# EAGLE schematic fp1 (EAGLE 6.5.0)
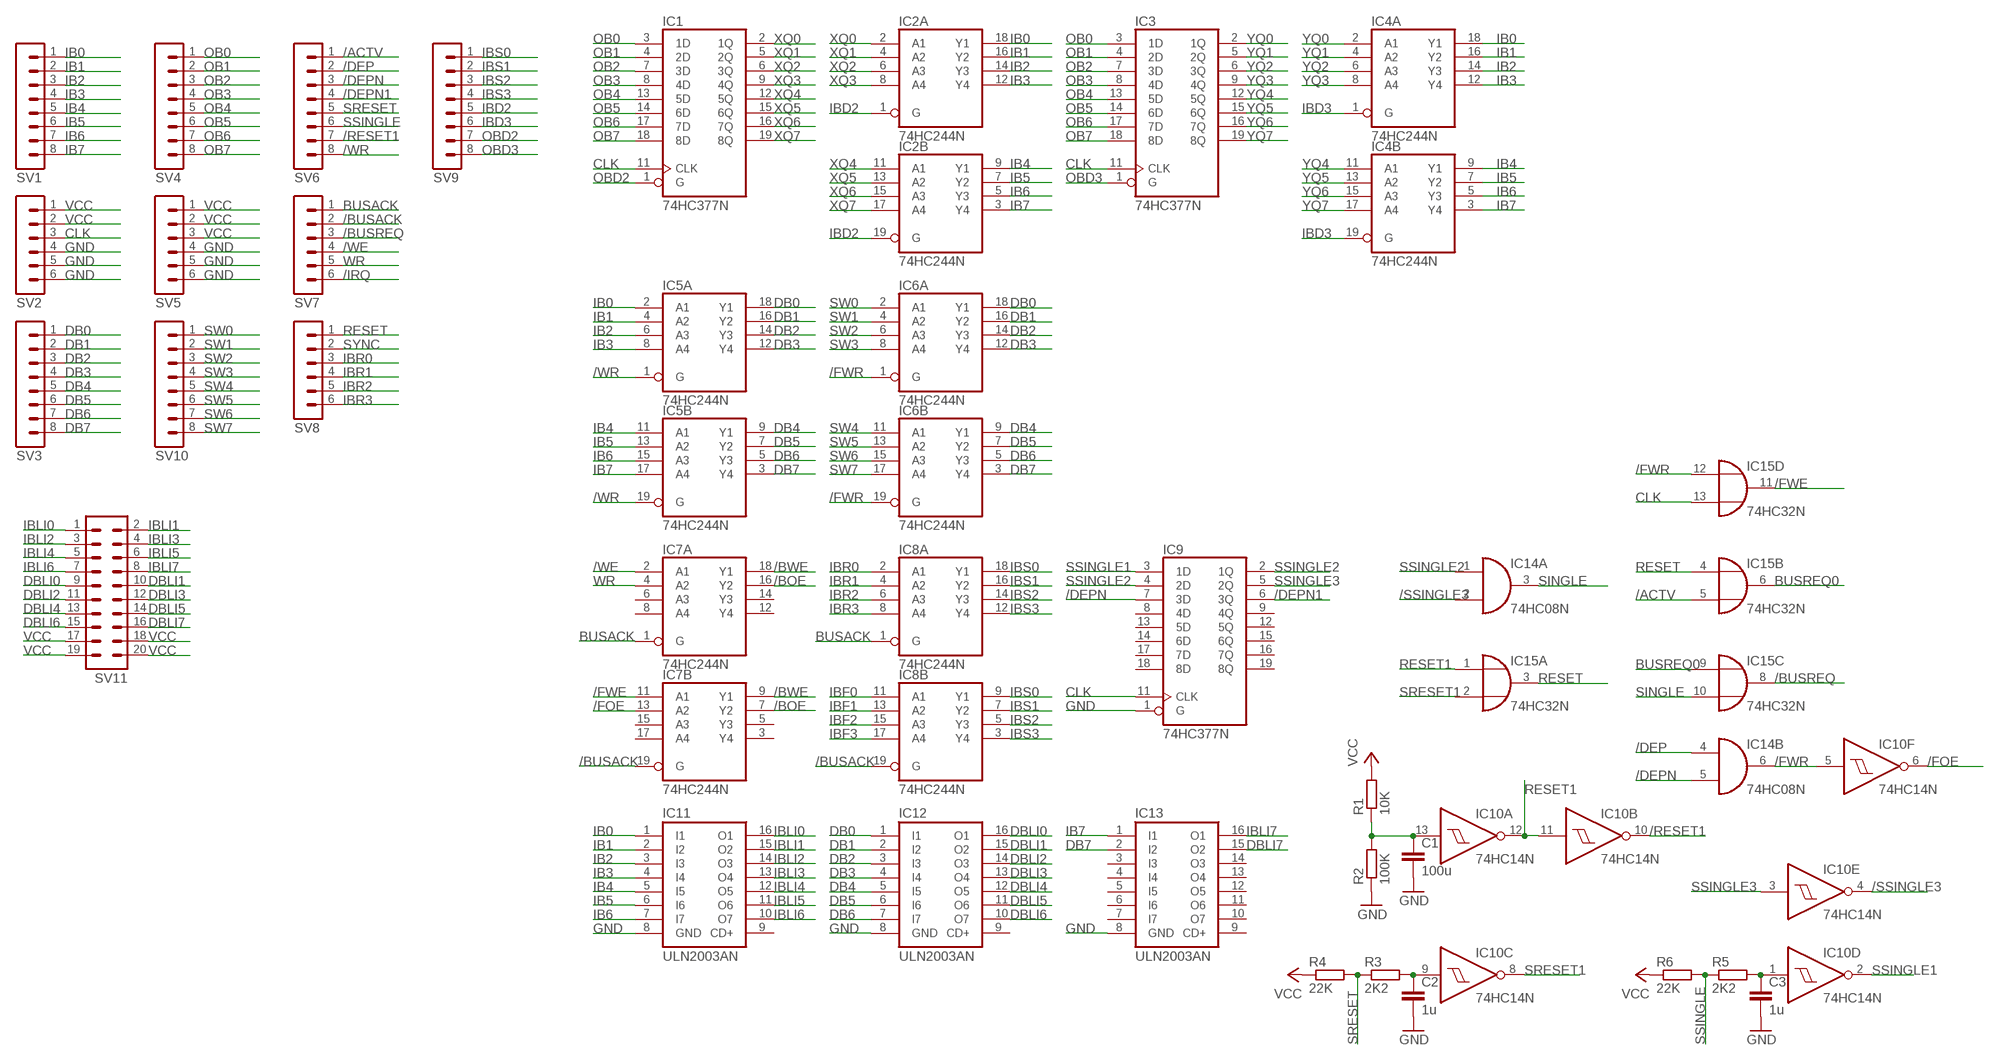
[diagram p0: schematic, sheet 1]

## Parts
C1  100u  C-EU025-024X044  [C025-024X044]
C2  1u  C-EU025-024X044  [C025-024X044]
C3  1u  C-EU025-024X044  [C025-024X044]
IC1  74HC377N  [DIL20]
IC2  74HC244N  [DIL20]
IC3  74HC377N  [DIL20]
IC4  74HC244N  [DIL20]
IC5  74HC244N  [DIL20]
IC6  74HC244N  [DIL20]
IC7  74HC244N  [DIL20]
IC8  74HC244N  [DIL20]
IC9  74HC377N  [DIL20]
IC10  74HC14N  [DIL14]
IC11  ULN2003AN  [DIL16]
IC12  ULN2003AN  [DIL16]
IC13  ULN2003AN  [DIL16]
IC14  74HC08N  [DIL14]
IC15  74HC32N  [DIL14]
R1  10K  R-EU_0207/7  [0207/7]
R2  100K  R-EU_0207/7  [0207/7]
R3  2K2  R-EU_0207/7  [0207/7]
R4  22K  R-EU_0207/7  [0207/7]
R5  2K2  R-EU_0207/7  [0207/7]
R6  22K  R-EU_0207/7  [0207/7]
SV1  MA08-1  [MA08-1]
SV2  MA06-1  [MA06-1]
SV3  MA08-1  [MA08-1]
SV4  MA08-1  [MA08-1]
SV5  MA06-1  [MA06-1]
SV6  MA08-1  [MA08-1]
SV7  MA06-1  [MA06-1]
SV8  MA06-1  [MA06-1]
SV9  MA08-1  [MA08-1]
SV10  MA08-1  [MA08-1]
SV11  MA10-2  [MA10-2]

## Nets
/ACTV: IC15.5(B:I1) SV6.1
/BOE: IC7.7(B:Y2) IC7.16(A:Y2)
/BUSACK: IC7.19(B:G) IC8.19(B:G) SV7.2
/BUSREQ: IC15.8(C:O) SV7.3
/BWE: IC7.9(B:Y1) IC7.18(A:Y1)
/DEP: IC14.4(B:I0) SV6.2
/DEPN: IC9.7(3D) IC14.5(B:I1) SV6.3
/DEPN1: IC9.6(3Q) SV6.4
/FOE: IC7.13(B:A2) IC10.6(F:O)
/FWE: IC7.11(B:A1) IC15.11(D:O)
/FWR: IC6.1(A:G) IC6.19(B:G) IC10.5(F:I) IC14.6(B:O) IC15.12(D:I0)
/IRQ: SV7.6
/RESET1: IC10.10(B:O) SV6.7
/SSINGLE3: IC10.4(E:O) IC14.2(A:I1)
/WE: IC7.2(A:A1) SV7.4
/WR: IC5.1(A:G) IC5.19(B:G) SV6.8
BUSACK: IC7.1(A:G) IC8.1(A:G) SV7.1
BUSREQ0: IC15.6(B:O) IC15.9(C:I0)
CLK: IC1.11(CLK) IC3.11(CLK) IC9.11(CLK) IC15.13(D:I1) SV2.3
DB0: IC5.18(A:Y1) IC6.18(A:Y1) IC12.1(I1) SV3.1
DB1: IC5.16(A:Y2) IC6.16(A:Y2) IC12.2(I2) SV3.2
DB2: IC5.14(A:Y3) IC6.14(A:Y3) IC12.3(I3) SV3.3
DB3: IC5.12(A:Y4) IC6.12(A:Y4) IC12.4(I4) SV3.4
DB4: IC5.9(B:Y1) IC6.9(B:Y1) IC12.5(I5) SV3.5
DB5: IC5.7(B:Y2) IC6.7(B:Y2) IC12.6(I6) SV3.6
DB6: IC5.5(B:Y3) IC6.5(B:Y3) IC12.7(I7) SV3.7
DB7: IC5.3(B:Y4) IC6.3(B:Y4) IC13.2(I2) SV3.8
DBLI0: IC12.16(O1) SV11.9
DBLI1: IC12.15(O2) SV11.10
DBLI2: IC12.14(O3) SV11.11
DBLI3: IC12.13(O4) SV11.12
DBLI4: IC12.12(O5) SV11.13
DBLI5: IC12.11(O6) SV11.14
DBLI6: IC12.10(O7) SV11.15
DBLI7: IC13.15(O2) SV11.16
GND: C1.2 C2.2 C3.2 IC9.1(G) IC11.8(GND) IC12.8(GND) IC13.8(GND) R2.1 SV2.4 SV2.5 SV2.6 SV5.4 SV5.5 SV5.6
IB0: IC2.18(A:Y1) IC4.18(A:Y1) IC5.2(A:A1) IC11.1(I1) SV1.1
IB1: IC2.16(A:Y2) IC4.16(A:Y2) IC5.4(A:A2) IC11.2(I2) SV1.2
IB2: IC2.14(A:Y3) IC4.14(A:Y3) IC5.6(A:A3) IC11.3(I3) SV1.3
IB3: IC2.12(A:Y4) IC4.12(A:Y4) IC5.8(A:A4) IC11.4(I4) SV1.4
IB4: IC2.9(B:Y1) IC4.9(B:Y1) IC5.11(B:A1) IC11.5(I5) SV1.5
IB5: IC2.7(B:Y2) IC4.7(B:Y2) IC5.13(B:A2) IC11.6(I6) SV1.6
IB6: IC2.5(B:Y3) IC4.5(B:Y3) IC5.15(B:A3) IC11.7(I7) SV1.7
IB7: IC2.3(B:Y4) IC4.3(B:Y4) IC5.17(B:A4) IC13.1(I1) SV1.8
IBD2: IC2.1(A:G) IC2.19(B:G) SV9.5
IBD3: IC4.1(A:G) IC4.19(B:G) SV9.6
IBF0: IC8.11(B:A1)
IBF1: IC8.13(B:A2)
IBF2: IC8.15(B:A3)
IBF3: IC8.17(B:A4)
IBLI0: IC11.16(O1) SV11.1
IBLI1: IC11.15(O2) SV11.2
IBLI2: IC11.14(O3) SV11.3
IBLI3: IC11.13(O4) SV11.4
IBLI4: IC11.12(O5) SV11.5
IBLI5: IC11.11(O6) SV11.6
IBLI6: IC11.10(O7) SV11.7
IBLI7: IC13.16(O1) SV11.8
IBR0: IC8.2(A:A1) SV8.3
IBR1: IC8.4(A:A2) SV8.4
IBR2: IC8.6(A:A3) SV8.5
IBR3: IC8.8(A:A4) SV8.6
IBS0: IC8.9(B:Y1) IC8.18(A:Y1) SV9.1
IBS1: IC8.7(B:Y2) IC8.16(A:Y2) SV9.2
IBS2: IC8.5(B:Y3) IC8.14(A:Y3) SV9.3
IBS3: IC8.3(B:Y4) IC8.12(A:Y4) SV9.4
OB0: IC1.3(1D) IC3.3(1D) SV4.1
OB1: IC1.4(2D) IC3.4(2D) SV4.2
OB2: IC1.7(3D) IC3.7(3D) SV4.3
OB3: IC1.8(4D) IC3.8(4D) SV4.4
OB4: IC1.13(5D) IC3.13(5D) SV4.5
OB5: IC1.14(6D) IC3.14(6D) SV4.6
OB6: IC1.17(7D) IC3.17(7D) SV4.7
OB7: IC1.18(8D) IC3.18(8D) SV4.8
OBD2: IC1.1(G) SV9.7
OBD3: IC3.1(G) SV9.8
RESET: IC15.3(A:O) IC15.4(B:I0) SV8.1
RESET0: C1.1 IC10.13(A:I) R1.1 R2.2
RESET1: IC10.11(B:I) IC10.12(A:O) IC15.1(A:I0)
SINGLE: IC14.3(A:O) IC15.10(C:I1)
SRESET: R3.1 R4.2 SV6.5
SRESET0: C2.1 IC10.9(C:I) R3.2
SRESET1: IC10.8(C:O) IC15.2(A:I1)
SSINGLE: R5.1 R6.2 SV6.6
SSINGLE0: C3.1 IC10.1(D:I) R5.2
SSINGLE1: IC9.3(1D) IC10.2(D:O)
SSINGLE2: IC9.2(1Q) IC9.4(2D) IC14.1(A:I0)
SSINGLE3: IC9.5(2Q) IC10.3(E:I)
SW0: IC6.2(A:A1) SV10.1
SW1: IC6.4(A:A2) SV10.2
SW2: IC6.6(A:A3) SV10.3
SW3: IC6.8(A:A4) SV10.4
SW4: IC6.11(B:A1) SV10.5
SW5: IC6.13(B:A2) SV10.6
SW6: IC6.15(B:A3) SV10.7
SW7: IC6.17(B:A4) SV10.8
SYNC: SV8.2
VCC: R1.2 R4.1 R6.1 SV2.1 SV2.2 SV5.1 SV5.2 SV5.3 SV11.17 SV11.18 SV11.19 SV11.20
WR: IC7.4(A:A2) SV7.5
XQ0: IC1.2(1Q) IC2.2(A:A1)
XQ1: IC1.5(2Q) IC2.4(A:A2)
XQ2: IC1.6(3Q) IC2.6(A:A3)
XQ3: IC1.9(4Q) IC2.8(A:A4)
XQ4: IC1.12(5Q) IC2.11(B:A1)
XQ5: IC1.15(6Q) IC2.13(B:A2)
XQ6: IC1.16(7Q) IC2.15(B:A3)
XQ7: IC1.19(8Q) IC2.17(B:A4)
YQ0: IC3.2(1Q) IC4.2(A:A1)
YQ1: IC3.5(2Q) IC4.4(A:A2)
YQ2: IC3.6(3Q) IC4.6(A:A3)
YQ3: IC3.9(4Q) IC4.8(A:A4)
YQ4: IC3.12(5Q) IC4.11(B:A1)
YQ5: IC3.15(6Q) IC4.13(B:A2)
YQ6: IC3.16(7Q) IC4.15(B:A3)
YQ7: IC3.19(8Q) IC4.17(B:A4)
Unconnected: IC7.3(B:Y4) IC7.5(B:Y3) IC7.6(A:A3) IC7.8(A:A4) IC7.12(A:Y4) IC7.14(A:Y3) IC7.15(B:A3) IC7.17(B:A4) IC9.8(4D) IC9.9(4Q) IC9.12(5Q) IC9.13(5D) IC9.14(6D) IC9.15(6Q) IC9.16(7Q) IC9.17(7D) IC9.18(8D) IC9.19(8Q) IC11.9(CD+) IC12.9(CD+) IC13.3(I3) IC13.4(I4) IC13.5(I5) IC13.6(I6) IC13.7(I7) IC13.9(CD+) IC13.10(O7) IC13.11(O6) IC13.12(O5) IC13.13(O4) IC13.14(O3) IC14.8(C:O) IC14.9(C:I0) IC14.10(C:I1) IC14.11(D:O) IC14.12(D:I0) IC14.13(D:I1)

## Power pins joined to a net without a drawn wire
GND: IC1.10(GND) IC2.10(P:GND) IC3.10(GND) IC4.10(P:GND) IC5.10(P:GND) IC6.10(P:GND) IC7.10(P:GND) IC8.10(P:GND) IC9.10(GND) IC10.7(P:GND) IC14.7(P:GND) IC15.7(P:GND)
VCC: IC1.20(VCC) IC2.20(P:VCC) IC3.20(VCC) IC4.20(P:VCC) IC5.20(P:VCC) IC6.20(P:VCC) IC7.20(P:VCC) IC8.20(P:VCC) IC9.20(VCC) IC10.14(P:VCC) IC14.14(P:VCC) IC15.14(P:VCC)

## Library data of the parts
C1-C3 = rcl:C-EU: CAPACITOR, European symbol
IC1 IC3 IC9 = 74xx-eu:74*377: Octal D type FLIP FLOP, enable
IC2 IC4-IC8 = 74xx-eu:74*244: Octal BUFFER and LINE DRIVER, 3-state
IC10 = 74xx-eu:74*14: Hex schmitt trigger INVERTER
IC11-IC13 = uln-udn:ULN2003A: DRIVER ARRAY
IC14 = 74xx-eu:74*08: Quad 2-input AND gate
IC15 = 74xx-eu:74*32: Quad 2-input OR gate
R1-R6 = rcl:R-EU_: RESISTOR, European symbol
SV1 SV3 SV4 SV6 SV9 SV10 = con-lstb:MA08-1: PIN HEADER; OC_FARNELL: unknown; OC_NEWARK: unknown
SV2 SV5 SV7 SV8 = con-lstb:MA06-1: PIN HEADER; OC_FARNELL: unknown; OC_NEWARK: unknown
SV11 = con-lstb:MA10-2: PIN HEADER; OC_FARNELL: unknown; OC_NEWARK: unknown